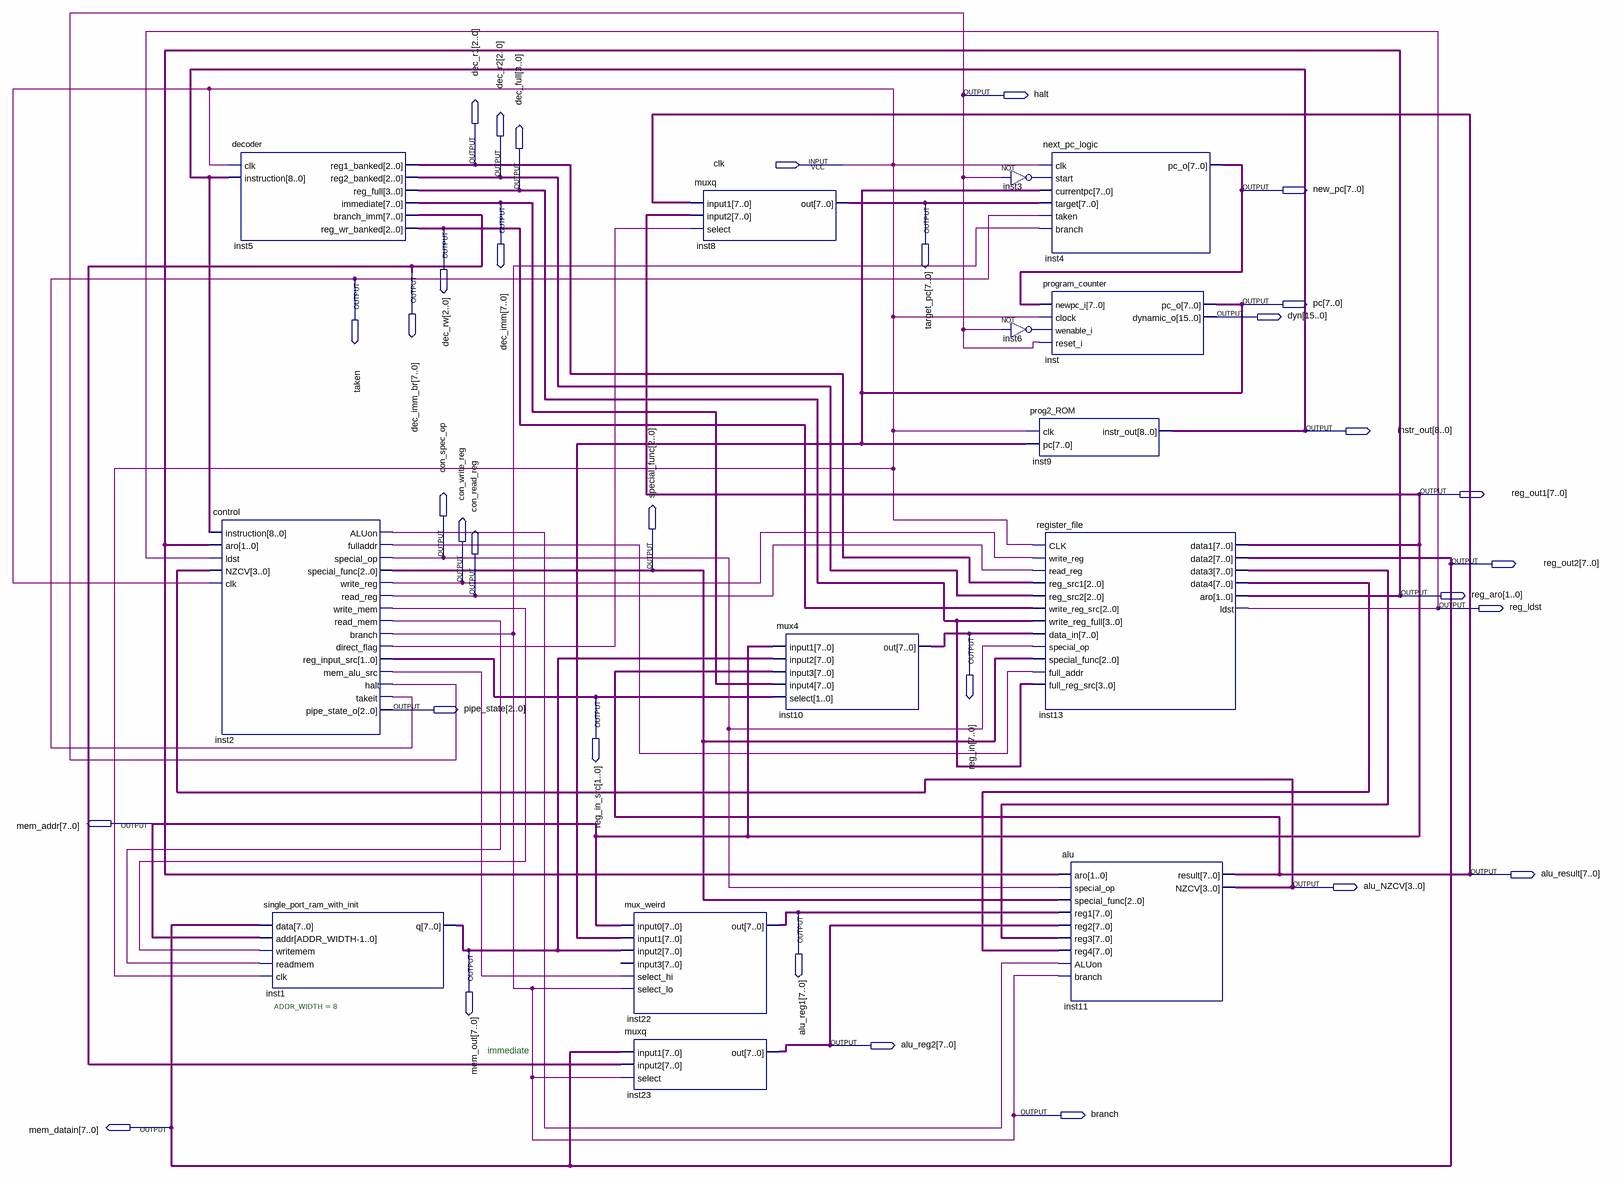
[diagram p0: schematic sheet]
// Quartus schematic pc_schematic.bdf as structural Verilog: 14 symbols, 33 pins
module pc_schematic (
  input  clk,
  output halt,
  output [2:0] dec_r1,
  output [2:0] dec_r2,
  output [3:0] dec_full,
  output [7:0] new_pc,
  output [7:0] dec_imm,
  output [7:0] target_pc,
  output [2:0] dec_rw,
  output [7:0] dec_imm_br,
  output taken,
  output [7:0] pc,
  output [15:0] dyn,
  output [8:0] instr_out,
  output [7:0] reg_out1,
  output con_spec_op,
  output [7:0] reg_out2,
  output [2:0] special_func,
  output con_write_reg,
  output con_read_reg,
  output [1:0] reg_aro,
  output reg_ldst,
  output [7:0] reg_in,
  output [1:0] reg_in_src,
  output [2:0] pipe_state,
  output [7:0] mem_addr,
  output [7:0] alu_result,
  output [3:0] alu_NZCV,
  output [7:0] alu_reg1,
  output [7:0] mem_out,
  output [7:0] alu_reg2,
  output branch,
  output [7:0] mem_datain
);

  wire inst2_aluon, inst2_direct_flag, inst2_fulladdr, inst2_mem_alu_src, inst2_read_mem, inst2_write_mem,
       inst3_out, inst6_out;
  wire [7:0] inst13_data3, inst13_data4;

  decoder inst5 (
    .clk(clk), .instruction(instr_out), .reg1_banked(dec_r1), .reg2_banked(dec_r2), .reg_full(dec_full),
    .immediate(dec_imm), .branch_imm(dec_imm_br), .reg_wr_banked(dec_rw));
  control inst2 (
    .instruction(instr_out), .aro(reg_aro), .ldst(reg_ldst), .NZCV(alu_NZCV), .clk(clk), .ALUon(inst2_aluon),
    .fulladdr(inst2_fulladdr), .special_op(con_spec_op), .special_func(special_func),
    .write_reg(con_write_reg), .read_reg(con_read_reg), .write_mem(inst2_write_mem),
    .read_mem(inst2_read_mem), .branch(branch), .direct_flag(inst2_direct_flag), .reg_input_src(reg_in_src),
    .mem_alu_src(inst2_mem_alu_src), .halt(halt), .takeit(taken), .pipe_state_o(pipe_state));
  single_port_ram_with_init #(.ADDR_WIDTH(8)) inst1 (
    .data(mem_datain), .addr(mem_addr), .writemem(inst2_write_mem), .readmem(inst2_read_mem), .clk(clk),
    .q(mem_out));
  mux_weird inst22 (
    .input0(mem_addr), .input1(pc), .input2(mem_out), .select_hi(inst2_mem_alu_src), .select_lo(branch),
    .out(alu_reg1));  // open: input3
  muxq inst23 (.input1(mem_datain), .input2(dec_imm_br), .select(branch), .out(alu_reg2));
  muxq inst8 (.input1(alu_result), .input2(mem_addr), .select(inst2_direct_flag), .out(target_pc));
  mux4 inst10 (
    .input1(mem_addr), .input2(mem_out), .input3(alu_result), .input4(dec_imm), .select(reg_in_src),
    .out(reg_in));
  next_pc_logic inst4 (
    .clk(clk), .start(inst3_out), .currentpc(pc), .target(target_pc), .taken(taken), .branch(branch),
    .pc_o(new_pc));
  not inst3 (inst3_out, halt);
  program_counter inst (
    .newpc_i(new_pc), .clock(clk), .wenable_i(inst6_out), .reset_i(halt), .pc_o(pc), .dynamic_o(dyn));
  not inst6 (inst6_out, halt);
  prog2_ROM inst9 (.clk(clk), .pc(pc), .instr_out(instr_out));
  register_file inst13 (
    .CLK(clk), .write_reg(con_write_reg), .read_reg(con_read_reg), .reg_src1(dec_r1), .reg_src2(dec_r2),
    .write_reg_src(dec_rw), .write_reg_full(dec_full), .data_in(reg_in), .special_op(con_spec_op),
    .special_func(special_func), .full_addr(inst2_fulladdr), .full_reg_src(dec_full), .data1(mem_addr),
    .data2(mem_datain), .data3(inst13_data3), .data4(inst13_data4), .aro(reg_aro), .ldst(reg_ldst));
  alu inst11 (
    .aro(reg_aro), .special_op(con_spec_op), .special_func(special_func), .reg1(alu_reg1), .reg2(alu_reg2),
    .reg3(inst13_data3), .reg4(inst13_data4), .ALUon(inst2_aluon), .branch(branch), .result(alu_result),
    .NZCV(alu_NZCV));

  assign reg_out1 = mem_addr;
  assign reg_out2 = mem_datain;

  // Notes on the sheet:
  //   immediate
endmodule
